# EAGLE design USBHUB (EAGLE 6.5.0)
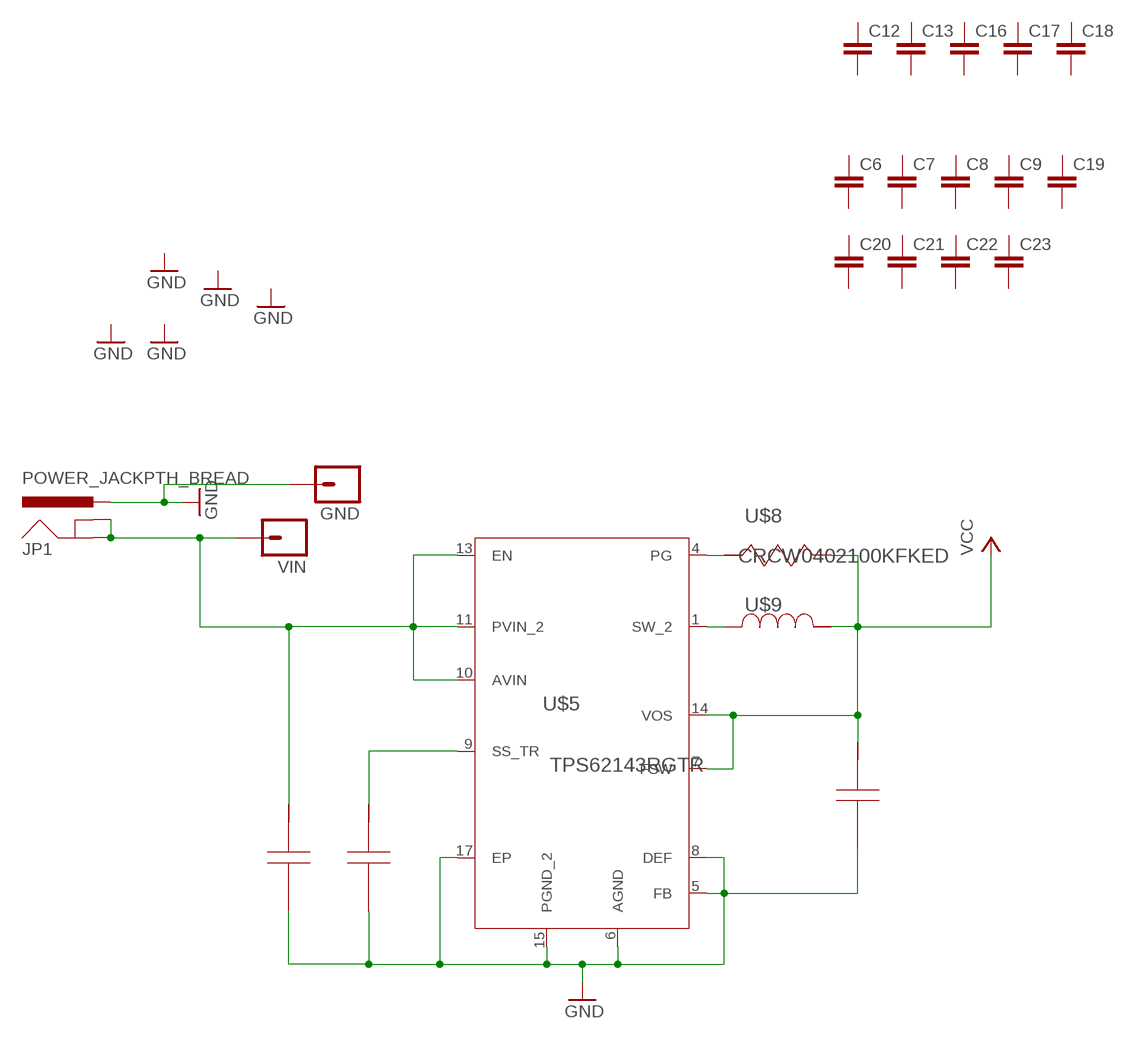
[diagram p0: schematic, sheet 1, part 1 of 2]
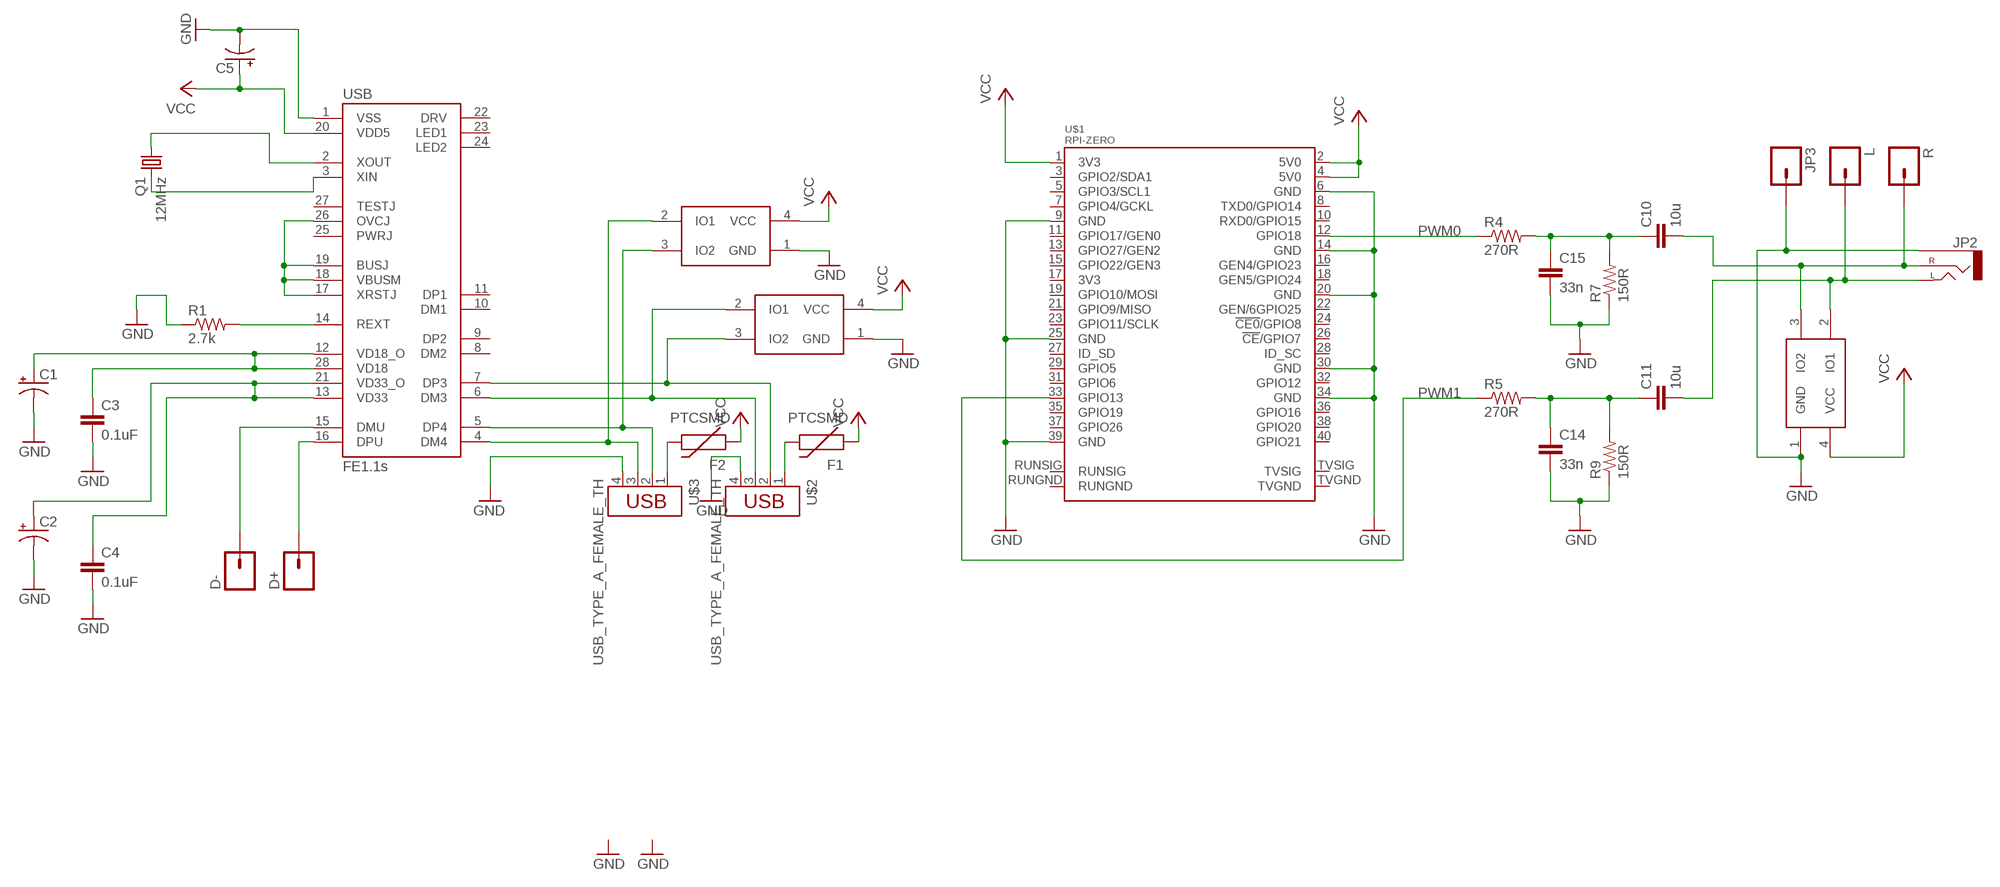
[diagram p1: schematic, sheet 1, part 2 of 2]

## Parts
C1  CAP_POL1206  [EIA3216]
C2  CAP_POL1206  [EIA3216]
C3  0.1uF  0.1UF-25V(+80/-20%)(0603)  [0603-CAP]
C4  0.1uF  0.1UF-25V(+80/-20%)(0603)  [0603-CAP]
C5  CAP_POL1206  [EIA3216]
C6  CAP0402-CAP  [0402-CAP]
C7  CAP0402-CAP  [0402-CAP]
C8  CAP0402-CAP  [0402-CAP]
C9  CAP0402-CAP  [0402-CAP]
C10  10u  CAP0603-CAP  [0603-CAP]
C11  10u  CAP0603-CAP  [0603-CAP]
C12  CAP0402-CAP  [0402-CAP]
C13  CAP0402-CAP  [0402-CAP]
C14  33n  CAP0603-CAP  [0603-CAP]
C15  33n  CAP0603-CAP  [0603-CAP]
C16  CAP0402-CAP  [0402-CAP]
C17  CAP0402-CAP  [0402-CAP]
C18  CAP0402-CAP  [0402-CAP]
C19  CAP0402-CAP  [0402-CAP]
C20  CAP0402-CAP  [0402-CAP]
C21  CAP0402-CAP  [0402-CAP]
C22  CAP0402-CAP  [0402-CAP]
C23  CAP0402-CAP  [0402-CAP]
D+  M01NOSILK-KIT  [1X01NS-KIT]
D-  M01NOSILK-KIT  [1X01NS-KIT]
F1  PTCSMD  [PTC-1206]
F2  PTCSMD  [PTC-1206]
GND  M01NOSILK-KIT  [1X01NS-KIT]
JP1  POWER_JACKPTH_BREAD  [POWER_JACK_PTH_BREAD]
JP2  AUDIO-JACKSMD2  [AUDIO-JACK-3.5MM-SMD]
JP3  M01NOSILK-KIT  [1X01NS-KIT]
L  M01NOSILK-KIT  [1X01NS-KIT]
Q1  12MHz  CRYSTALCTS406  [CTS406]
R  M01NOSILK-KIT  [1X01NS-KIT]
R1  2.7k  RESISTOR0603  [0603-RES]
R4  270R  RESISTOR0603-RES  [0603-RES]
R5  270R  RESISTOR0603-RES  [0603-RES]
R7  150R  RESISTOR0603-RES  [0603-RES]
R9  150R  RESISTOR0603-RES  [0603-RES]
U$1  RPI-ZERO  [RASPBERRYPI_BASTELSTUBE_V13_RASPI_BOARD_B+_FULL]
U$2  USB_TYPE_A_FEMALE_TH  [USB_TYPE_A_FEMALE_TH]
U$3  USB_TYPE_A_FEMALE_TH  [USB_TYPE_A_FEMALE_TH]
U$4  PRTR5VV0U2X  [SOT143B]
U$5  TPS62143RGTR  [S-PVQFN-N16]
U$6  PRTR5VV0U2X  [SOT143B]
U$7  PRTR5VV0U2X  [SOT143B]
U$8  CRCW0402100KFKED  [0402]
U$9  IHLP1212BZER2R2M11  [IHLP-1212BZ]
U$10  TMK316BJ106KL-T  [1206]
U$11  TMK316BJ106KL-T  [1206]
U$12  TMK316BJ106KL-T  [1206]
USB  FE1.1S  [FE1.1S_SSOP-28]
VIN  M01NOSILK-KIT  [1X01NS-KIT]

## Nets
3V3: U$1.1(3V3) U$7.4(VCC) ; supply symbol labelled VCC
GND: C1.C(-) C2.C(-) C3.2 C4.2 C5.C(-) C14.2 C15.2 GND.1 JP1.PWR JP2.SLEEVE JP3.1 R1.1 R7.1 R9.1 U$1.6(GND) U$1.9(GND) U$1.14(GND) U$1.20(GND) U$1.25(GND) U$1.30(GND) U$1.34(GND) U$1.39(GND) U$2.4 U$3.4 U$4.1(GND) U$5.5(FB) U$5.6(AGND) U$5.8(DEF) U$5.15(PGND_2) U$5.17(EP) U$6.1(GND) U$7.1(GND) U$10.2 U$11.2 U$12.2 USB.1(VSS)
N$1: U$2.3 U$4.2(IO1) USB.6(DM3)
N$2: U$2.2 U$4.3(IO2) USB.7(DP3)
N$3: U$5.1(SW_2) U$9.1
N$4: U$5.4(PG) U$8.2
N$5: D-.1 USB.15(DMU)
N$6: D+.1 USB.16(DPU)
N$7: USB.17(XRSTJ) USB.18(VBUSM) USB.19(BUSJ) USB.26(OVCJ)
N$8: Q1.1 USB.2(XOUT)
N$9: Q1.3 USB.3(XIN)
N$10: C2.A(+) C4.1 USB.13(VD33) USB.21(VD33_O)
N$11: U$3.3 U$6.2(IO1) USB.4(DM4)
N$12: R1.2 USB.14(REXT)
N$13: C1.A(+) C3.1 USB.12(VD18_O) USB.28(VD18)
N$16: F2.2 U$3.1
N$17: U$3.2 U$6.3(IO2) USB.5(DP4)
N$19: F1.2 U$2.1
N$20: C10.1 C15.1 R4.2 R7.2
N$21: C11.2 JP2.TIP(LEFT) L.1 U$7.2(IO1)
N$22: C11.1 C14.1 R5.2 R9.2
N$23: C10.2 JP2.RING(RIGHT) R.1 U$7.3(IO2)
N$24: U$5.9(SS_TR) U$11.1
PWM0: R4.1 U$1.12(GPIO18)
PWM1: R5.1 U$1.33(GPIO13)
VCC: C5.A(+) F1.1 F2.1 U$1.2(5V0) U$1.4(5V0) U$4.4(VCC) U$5.7(FSW) U$5.14(VOS) U$6.4(VCC) U$8.1 U$9.2 U$10.1 USB.20(VDD5)
VIN: JP1.GND JP1.GNDBREAK U$5.10(AVIN) U$5.11(PVIN_2) U$5.13(EN) U$12.1 VIN.1
Unconnected: C6.1 C6.2 C7.1 C7.2 C8.1 C8.2 C9.1 C9.2 C12.1 C12.2 C13.1 C13.2 C16.1 C16.2 C17.1 C17.2 C18.1 C18.2 C19.1 C19.2 C20.1 C20.2 C21.1 C21.2 C22.1 C22.2 C23.1 C23.2 U$1.3(GPIO2/SDA1) U$1.5(GPIO3/SCL1) U$1.7(GPIO4/GCKL) U$1.8(TXD0/GPIO14) U$1.10(RXD0/GPIO15) U$1.11(GPIO17/GEN0) U$1.13(GPIO27/GEN2) U$1.15(GPIO22/GEN3) U$1.16(GEN4/GPIO23) U$1.17(3V3) U$1.18(GEN5/GPIO24) U$1.19(GPIO10/MOSI) U$1.21(GPIO9/MISO) U$1.22(GEN/6GPIO25) U$1.23(GPIO11/SCLK) U$1.24(!CE0!/GPIO8) U$1.26(!CE!/GPIO7) U$1.27(ID_SD) U$1.28(ID_SC) U$1.29(GPIO5) U$1.31(GPIO6) U$1.32(GPIO12) U$1.35(GPIO19) U$1.36(GPIO16) U$1.37(GPIO26) U$1.38(GPIO20) U$1.40(GPIO21) U$1.RUNGND U$1.RUNSIG U$1.TVGND U$1.TVSIG USB.8(DM2) USB.9(DP2) USB.10(DM1) USB.11(DP1) USB.22(DRV) USB.23(LED1) USB.24(LED2) USB.25(PWRJ) USB.27(TESTJ)

## Library data of the parts
C1 C2 C5 = SparkFun-Capacitors:CAP_POL: Capacitor Polarized These are standard SMD and PTH capacitors. Normally 10uF, 47uF, and 100uF in electrolytic and tantalum varieties. Always verify the external diameter of the through hole cap, it varies with capacity, voltage, and manufacturer. The EIA devices should be standard.
C3 C4 = SparkFun-Capacitors:0.1UF-25V(+80/-20%)(0603): CAP-00810 Ceramic Standard decoupling cap; PROD_ID: CAP-00810
C6-C23 = SparkFun-Passives:CAP: Capacitor Standard 0603 ceramic capacitor, and 0.1" leaded capacitor.
D+ D- GND JP3 L R VIN = SparkFun-Connectors:M01: Header 1 Standard 1-pin 0.1" header. Use with straight break away headers (SKU : PRT-00116), right angle break away headers (PRT-00553), swiss pins (PRT-00743), machine pins (PRT-00117), and female headers (PRT-00115).
F1 F2 = SparkFun-PowerIC:PTC: Resettable Fuse PTC Resettable Fuse. Spark Fun Electronics SKU : COM-08357; PROD_ID: RES-11150
JP1 = SparkFun-Connectors:POWER_JACK: Power Jack This is the standard 5.5mm barrel jack for power. The PTH is the most common, proven, reliable, footprint. The Slot footprint only works if the mill layer is transmitted to the PCB fab house so be warned. Mating wall wart : TOL-00298 (and others); PROD_ID: PRT-10811
JP2 = SparkFun-Connectors:AUDIO-JACK: 3.5mm Audio Jack Simple 3.5mm common PCB mount audio jack. Variant PTH is our storefront SKU PRT-08032; PROD_ID: CONN-10353
Q1 = adafruit:CRYSTAL: CRYSTAL; OC_FARNELL: unknown; OC_NEWARK: unknown
R1 = SparkFun-Resistors:RESISTOR: Resistor Basic schematic elements and footprints for 0603, 1206, and PTH resistors.
R4 R5 R7 R9 = SparkFun-Passives:RESISTOR: Resistor Basic schematic elements and footprints for 0603, 1206, and PTH resistors.
U$1 = RPI-Zero:RPI-ZERO
U$2 U$3 = imcom:USB_TYPE_A_FEMALE_TH: USB Type A Female Through Hole. http://datasheet.octopart.com/787616-1-Tyco-Electronics-datasheet-61477.pdf
U$4 U$6 U$7 = Benchoff:PRTR5VV0U2X
U$5 = TI Library 1:TPS62143RGTR; DATASHEETURL: http://www.ti.com/product/tps62131; FREQUENCY: 2500000.0; IMAX: 3.0; MANUFACTURER_NAME: Texas Instruments; MANUFACTURER_PART_NUMBER: TPS62131RGTR; MKTG_PACKAGE: S-PVQFN-N16; NSID: TPS62131RGTR; PACKAGE: S-PVQFN-N16; VENDOR: Texas Instruments
U$8 = TI Library 1:CRCW0402100KFKED; MANUFACTURER_NAME: Vishay-Dale; MANUFACTURER_PART_NUMBER: CRCW0402100KFKED; POWER: 0.063; RESISTANCE: 100000.0; TOLERANCE: 1.0; VENDOR: Vishay-Dale
U$9 = TI Library 1:IHLP1212BZER2R2M11; DATASHEETURL: http://www.vishay.com/docs/34289/lp12bz11.pdf; DCR: 46.0; DESCRIPTION: Unknown; IDC: 3.0; L: 2.2E-6; MANUFACTURER: Vishay; MANUFACTURER_NAME: Vishay-Dale; MANUFACTURER_PART_NUMBER: IHLP1212BZER2R2M11; PACKAGE_DESIGNATOR: IHLP-1212BZ; VENDOR: Vishay-Dale
U$10-U$12 = TI Library 1:TMK316BJ106KL-T; CAP: 1.0E-5; ESR: 0.0; IRMS: 0.0; MANUFACTURER_NAME: Taiyo Yuden; MANUFACTURER_PART_NUMBER: TMK316BJ106KL-T; VDC: 25.0; VENDOR: Taiyo Yuden
USB = imcom:FE1.1S: A USB 2.0 hub IC. http://www.jfd-ic.com/Documents/FE1.1s%20Data%20Sheet%20%28Rev.%201.0%29.pdf

## Board
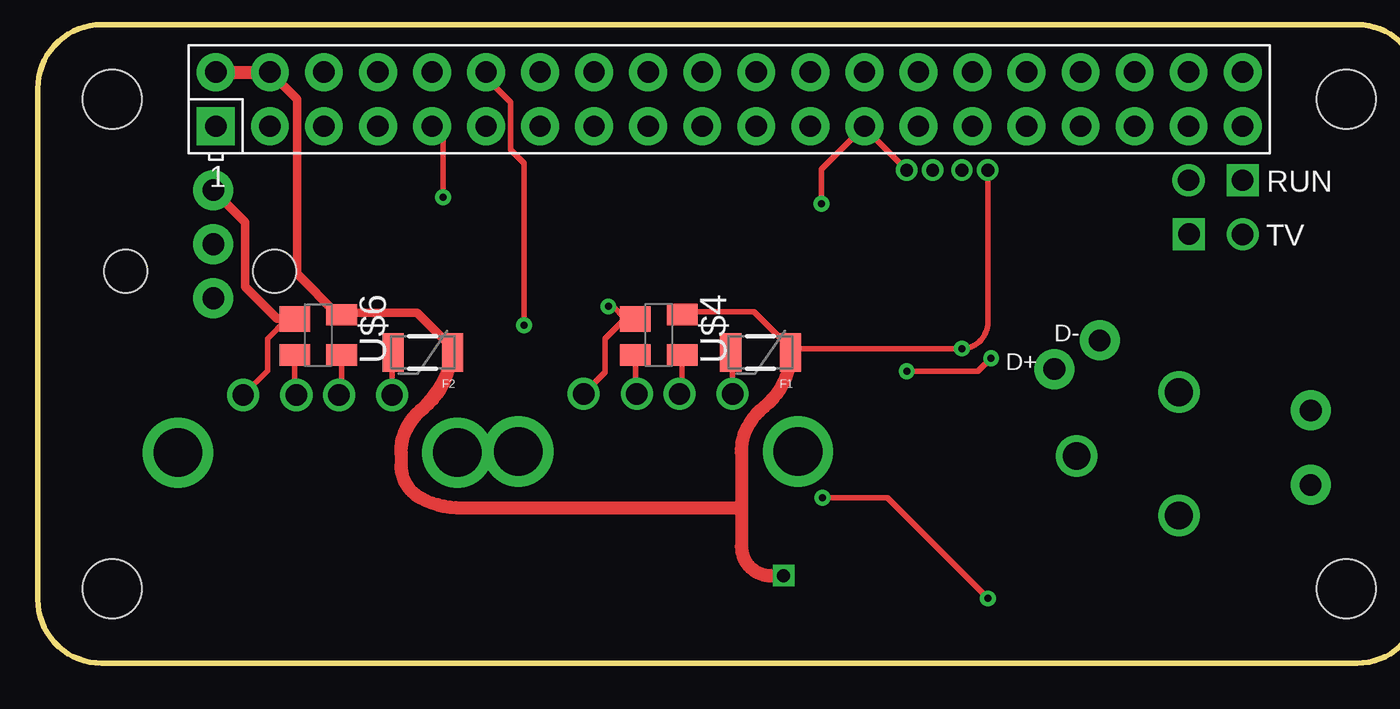
[diagram p2: board, top side]
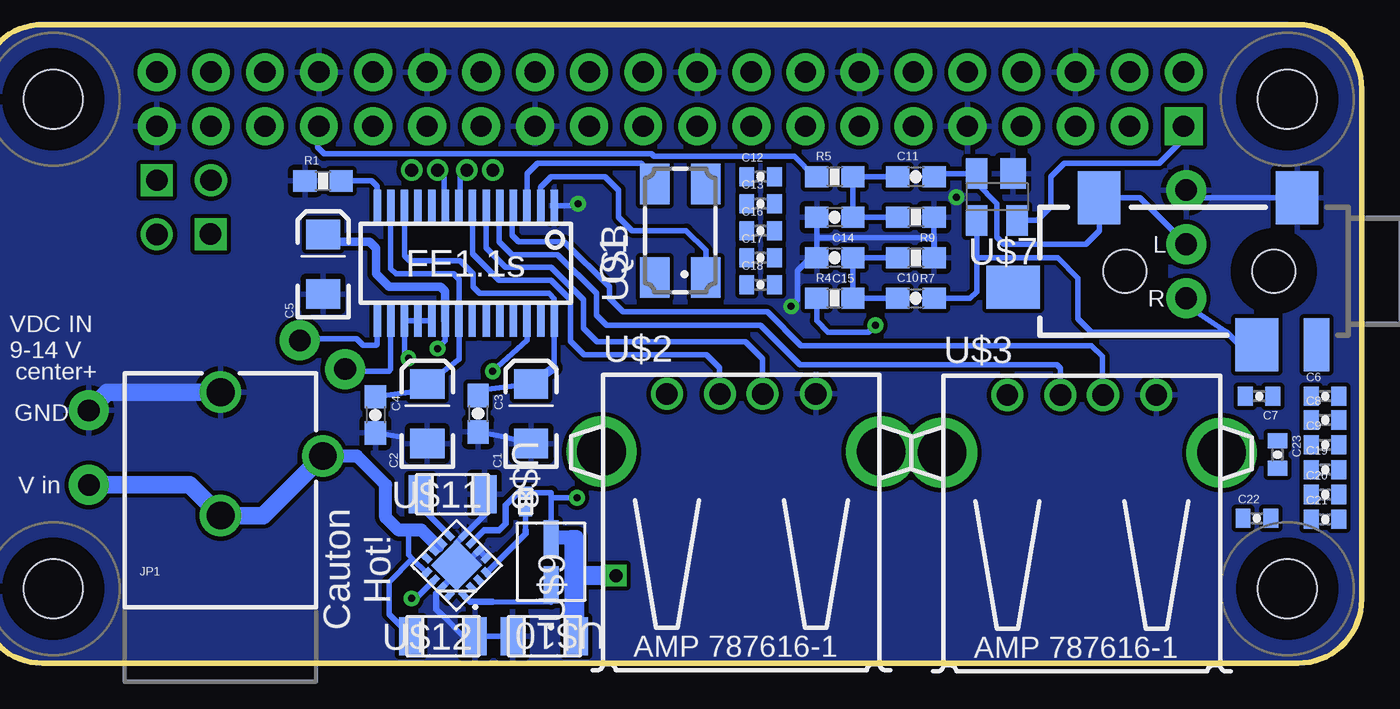
[diagram p3: board, bottom side, seen from below]

No outline drawn. Coordinates in mm, seen from the top.
Copper layers (1*16): Top 0.035mm / dielectric 1.5mm / Bottom 0.035mm
Design rules "default": minimum track width 10mil, minimum drill 24mil, track to track 8mil, track to pad 8mil, pad to pad 8mil, via to via 8mil, smd to smd 8mil, copper to edge 40mil, drill to drill 8mil, minimum pad ring 10mil, minimum via ring 8mil, stop-mask expansion 4mil, vias tented up to drill 0mil, thermal gap 10mil
Milling: 8 lines

### Footprints (pad centres in the part's own frame; a part is rotated, then mirrored left to right if it is on the bottom)
EIA3216 = smd 1.4 x 1.6: A 1.4,0; C -1.4,0
0603-CAP = smd 1.1 x 1: 1 -0.85,0; 2 0.85,0
0402-CAP = smd 0.7 x 0.9: 1 -0.65,0; 2 0.65,0
1X01NS-KIT = drill 1.016 pad 1.88: 1 0,0
PTC-1206 = smd 1 x 1.8: 1 -1.4,0; 2 1.4,0
POWER_JACK_PTH_BREAD = drill 1.3: GND 0,7.9; GNDBREAK 4.8,10.7; PWR 0,13.7
AUDIO-JACK-3.5MM-SMD = smd 2 x 2.5: RING 4.3,3.45; SLEEVE 2.4,-3.45; TIP 11.7,-3.45 | smd 1.2 x 2.5: RSH 1.5,3.45 | smd 2.5 x 2: TSH 15.75,0.75 | hole 2: 3.5,0; 10.5,0
CTS406 = smd 1.9 x 1.4: 1 -2.2,-1.2; 2 2.2,-1.2; 3 2.2,1.2; 4 -2.2,1.2
0603-RES = smd 1.1 x 1: 1 -0.85,0; 2 0.85,0
RASPBERRYPI_BASTELSTUBE_V13_RASPI_BOARD_B+_FULL = drill 1 pad 1.778 square: 1 8.37,25.23 | drill 1 pad 1.778: 2 8.37,27.77; 3 10.91,25.23; 4 10.91,27.77; 5 13.45,25.23; 6 13.45,27.77; 7 15.99,25.23; 8 15.99,27.77; 9 18.53,25.23; 10 18.53,27.77; 11 21.07,25.23; 12 21.07,27.77; 13 23.61,25.23; 14 23.61,27.77; 15 26.15,25.23; 16 26.15,27.77; 17 28.69,25.23; 18 28.69,27.77; 19 31.23,25.23; 20 31.23,27.77; 21 33.77,25.23; 22 33.77,27.77; 23 36.31,25.23; 24 36.31,27.77; 25 38.85,25.23; 26 38.85,27.77; 27 41.39,25.23; 28 41.39,27.77; 29 43.93,25.23; 30 43.93,27.77; 31 46.47,25.23; 32 46.47,27.77; 33 49.01,25.23; 34 49.01,27.77; 35 51.55,25.23; 36 51.55,27.77; 37 54.09,25.23; 38 54.09,27.77; 39 56.63,25.23; 40 56.63,27.77 | drill 1: RUNGND 54.087,22.687; TVGND 56.629,20.145 | drill 1 square: RUNSIG 56.629,22.687; TVSIG 54.105,20.163 | hole 2.75: 3.5,3.5; 3.5,26.5; 61.5,3.5; 61.5,26.5
USB_TYPE_A_FEMALE_TH = drill 1: 1 -3.5,5.37; 2 -1,5.37; 3 1,5.37; 4 3.5,5.37 | drill 2.286: P$1 -6.57,2.66; P$2 6.57,2.66
SOT143B = smd 1.2 x 1.44: 1 -0.75,-1.1 | smd 1 x 1.44: 2 0.95,-1.1; 3 0.95,1.1; 4 -0.95,1.1
S-PVQFN-N16 = smd 0.508 x 0.305: 1 -1.25,0.75; 2 -1.25,0.25; 3 -1.25,-0.25; 4 -1.25,-0.75; 9 1.25,-0.75; 10 1.25,-0.25; 11 1.25,0.25; 12 1.25,0.75 | smd 0.305 x 0.508: 5 -0.75,-1.25; 6 -0.25,-1.25; 7 0.25,-1.25; 8 0.75,-1.25; 13 0.75,1.25; 14 0.25,1.25; 15 -0.25,1.25; 16 -0.75,1.25 | smd 1.702 x 1.702: 17 0,0
0402 = smd 0.559 x 0.61: 1 -0.419,0; 2 0.419,0
IHLP-1212BZ = smd 1.753 x 0.711: 1 -1.079,0; 2 1.079,0
1206 = smd 1.118 x 1.803: 1 -1.499,0; 2 1.499,0
FE1.1S_SSOP-28 = smd 0.35 x 1.5: 1 -4.16,-2.7; 2 -3.52,-2.7; 3 -2.88,-2.7; 4 -2.24,-2.7; 5 -1.6,-2.7; 6 -0.96,-2.7; 7 -0.32,-2.7; 8 0.32,-2.7; 9 0.96,-2.7; 10 1.6,-2.7; 11 2.24,-2.7; 12 2.88,-2.7; 13 3.52,-2.7; 14 4.16,-2.7; 15 4.16,2.7; 16 3.52,2.7; 17 2.88,2.7; 18 2.24,2.7; 19 1.6,2.7; 20 0.96,2.7; 21 0.32,2.7; 22 -0.3,2.7; 23 -0.96,2.7; 24 -1.6,2.7; 25 -2.24,2.7; 26 -2.88,2.7; 27 -3.52,2.7; 28 -4.16,2.7

### Placement (x,y rotation side)
C1  39.04,11.72 90 bottom
C2  43.92,11.72 90 bottom
C3  41.53,11.72 270 bottom
C4  46.35,11.67 270 bottom
C5  48.82,18.75 90 bottom
C6  1.73,12.55 0 bottom
C7  4.83,12.55 180 bottom
C8  1.73,11.43 0 bottom
C9  1.73,10.26 0 bottom
C10  20.95,17.14 0 bottom
C11  20.95,22.86 0 bottom
C12  28.26,22.86 0 bottom
C13  28.26,21.59 0 bottom
C14  24.77,20.95 180 bottom
C15  24.77,19.05 180 bottom
C16  28.26,20.32 0 bottom
C17  28.26,19.05 0 bottom
C18  28.26,17.78 0 bottom
C19  1.73,9.09 0 bottom
C20  1.73,7.92 0 bottom
C21  1.73,6.76 0 bottom
C22  4.93,6.81 0 bottom
C23  3.96,9.8 270 bottom
D+  47.78,13.82 0 top
D-  49.91,15.16 0 top
F1  33.97,14.61 180 top
F2  18.1,14.61 180 top
GND  59.83,11.88 0 top
JP1  53.63,-0.97 0 bottom
JP2  0.64,18.41 180 bottom
JP3  8.26,22.23 0 top
L  8.26,19.68 0 top
Q1  32.03,20.32 90 bottom
R  8.26,17.14 0 top
R1  48.82,22.66 0 bottom
R4  24.77,17.14 0 bottom
R5  24.77,22.86 0 bottom
R7  20.95,19.05 180 bottom
R9  20.95,20.95 180 bottom
U$1  0,0 0 top
U$2  29.16,7.28 0 bottom
U$3  13.16,7.23 0 bottom
U$4  29.19,15.43 270 top
U$5  42.55,4.6 135 bottom
U$6  13.18,15.42 270 top
U$7  17.14,21.91 180 bottom
U$8  39.29,7.6 270 bottom
U$9  38.1,4.76 90 bottom
U$10  38.42,1.27 180 bottom
U$11  42.73,7.94 0 bottom
U$12  43.18,1.27 0 bottom
USB  42.11,18.8 180 bottom
VIN  59.82,8.38 0 top

### Tracks (layer width: path | path; a pad name or v marks a point on that pad's centre or on a via)
3V3
  Bottom 0.254: U$1.1 8.37,24.65 9.53,23.5 13.97,23.5 14.61,22.86 14.61,21.44 15.24,20.81 U$7.4
GND  (via drill 0.33)
  Top 0.254: U$4.1 27.61,16.18 | 27.61,16.18 26.67,15.24 26.67,13.66 U$2.4 | U$6.1 11.73,16.18 10.79,15.24 10.79,13.74 U$3.4 | 27.61,16.18 27.03,16.76 v26.82,16.76 | v36.83,21.59 36.83,23.21 U$1.25 | v19.05,21.89 19.05,24.71 U$1.9
  Top 0.406: 11.73,16.18 11.26,16.18 9.75,17.68 9.75,20.73 JP3.1
  Bottom 0.254: C1.C 40.34,10.64 C3.2 | 43.37,10.87 C2.C | 45.22,10.64 C4.2 | 20.11,19.99 R7.1 20.09,19.99 20.11,19.99 | 20.11,19.99 R9.1 19.68,20.95 | C15.2 C14.2 | C15.2 25.6,19.99 20.11,19.99 | JP2.SLEEVE 7.89,21.86 JP3.1 | U$5.5 U$5.6 42.19,4.6 U$5.17 42.55,4.24 U$5.15 43.5,3.29 | U$10.2 U$12.2 42.23,1.27 43.18,2.22 | v26.82,16.76 26.52,17.07 26.52,18.44 25.91,19.05 C15.2 | U$11.2 41.23,8.13 | USB.1 36.92,21.5 v36.83,21.59
  Bottom 0.305: U$5.17 42.55,5.66 U$5.8 41.23,6.97 U$11.2 | 43.5,3.29 43.5,2.54 43.18,2.22
  Bottom 0.813: GND.1 58.97,12.73 JP1.PWR
  pour Bottom: 3.51,30.02 arc90 0,26.52 0,3.2 arc90 3.2,0 3.35,0 61.57,0 62.03,0 arc90 64.92,2.9 64.92,4.27 64.92,26.97 arc90 61.87,30.02
N$1
  Top 0.254: U$4.2 28.09,12.73 U$2.3
  Bottom 0.254: USB.6 41.15,19.51 40.23,18.59 38.1,18.59 36.58,17.07 36.58,15.74 35.94,15.11 28.96,15.11 28.16,14.31 U$2.3
N$2
  Top 0.254: U$4.3 30.29,12.78 U$2.2
  Bottom 0.254: USB.7 41.79,19.24 40.54,17.98 38.1,17.98 37.19,17.07 37.19,15.13 36.55,14.5 30.79,14.5 30.18,13.89 30.18,12.67 U$2.2
N$3
  Bottom 0.254: 40.84,2.9 38.1,2.86 U$9.1
  Bottom 0.305: U$5.1 41.9,2.9 40.84,2.9
N$4
  Bottom 0.254: 39.29,6.25 U$8.2
  Bottom 0.305: U$5.4 39.29,6.08 39.29,6.25
N$5
  Bottom 0.254: USB.15 46.27,14.99 46.33,14.94 46.94,14.94 47.24,15.24 49.84,15.24 D-.1
N$6
  Bottom 0.254: USB.16 45.63,13.8 45.72,13.72 47.68,13.72 D+.1
N$7  (via drill 0.33 pad 0.25)
  Top 0.254: v40.84,13.72 44.2,13.72 v44.81,14.33
  Bottom 0.254: USB.19 USB.18 USB.17 44.99,14.51 v44.81,14.33 | USB.26 39.23,15.17 v40.84,13.72
N$8
  Bottom 0.254: Q1.1 30.83,19.4 31.75,20.32 34.29,20.32 34.92,20.95 34.92,22.23 35.56,22.86 38.1,22.86 38.59,22.37 USB.2
N$9
  Bottom 0.254: USB.3 39.23,23 38.73,23.5 33.86,23.5 33.23,22.86 Q1.3
N$10
  Bottom 0.254: C4.1 43.88,12.84 C2.A 42.43,14.29 USB.21 42.43,18.05 42.67,18.29 45.38,18.29 45.63,18.54 USB.13
N$11
  Top 0.254: U$6.2 12.08,12.68 U$3.3
  Bottom 0.254: USB.4 39.93,21.44 39.93,20.12 39.62,19.81 37.49,19.81 35.36,17.68 35.36,17.14 34.72,16.51 27.94,16.51 26.35,14.92 12.7,14.92 12.19,14.41 12.19,12.64 U$3.3
N$12
  Bottom 0.254: USB.14 46.27,22.4 46.53,22.66 R1.2
N$13
  Bottom 0.254: C1.A 41.61,12.8 C3.1 | 37.95,13.89 USB.28 37.95,17.12 38.21,17.37 41.45,17.37 41.76,17.68 41.76,18.29 42.37,18.9 44.74,18.9 44.99,19.15 USB.12
  Bottom 0.406: C1.A 37.95,13.89
N$14
  Bottom 0.61: 36.83,1.27 36.83,3.81 36.88,3.81 36.88,4.27 | 36.88,4.27 36.88,5.94 37.19,5.94 | 37.8,5.94 37.19,5.94 | 37.19,5.94 37.19,2.13 | 36.88,4.27 35.05,4.27
N$15
  Top 0.254: 16.66,14.47 16.66,12.6
N$16
  Top 0.254: F2.2 16.66,14.56 U$3.1
N$17
  Top 0.254: U$6.3 14.28,12.73 U$3.2
  Bottom 0.254: USB.5 40.54,21.47 40.54,19.81 39.93,19.2 37.8,19.2 35.97,17.37 35.97,16.35 35.49,15.88 28.26,15.88 26.4,14.02 14.33,14.02 14.16,13.85 U$3.2
N$18  (via drill 0.6)
  Bottom 0.254: 43.13,21.95 43.13,22.86 arc-90 v43.43,23.16
N$19
  Top 0.254: F1.2 32.66,14.52 U$2.1
N$20
  Bottom 0.254: C10.1 R4.2 C15.1 R7.2
N$21
  Bottom 0.254: C11.2 19.96,23.01 U$7.2 18.09,22.54 17.14,21.59 17.14,20 16.83,19.68 12.97,19.68 12.34,20.32 JP2.TIP 10.44,21.86 L.1
N$22
  Bottom 0.254: C11.1 R5.2 C14.1 R9.2
N$23
  Bottom 0.254: U$7.3 18.1,19.05 | 18.1,19.05 14.29,19.05 13.34,18.1 13.34,16.19 12.7,15.56 6.35,15.56 | 6.35,15.56 5.76,14.96 JP2.RING | C10.2 18.41,17.14 18.1,17.46 18.1,19.05 | R.1 8.26,16.83 6.35,15.56
N$24
  Bottom 0.305: U$5.9 44.23,7.34 U$11.1
N$25  (via drill 0.6)
  Bottom 0.254: 42.37,21.95 42.37,22.86 arc90 v42.06,23.16
N$26  (via drill 0.6)
  Top 0.254: v40.84,23.16 38.86,25.15 38.86,25.3
PWM0  (via drill 0.33)
  Top 0.254: v22.86,15.88 22.86,23.5 22.23,24.13 22.23,26.35 21.07,27.51 U$1.12
  Bottom 0.254: R4.1 25.61,16.09 25.08,15.56 23.18,15.56 v22.86,15.88
PWM1
  Bottom 0.254: R5.1 25.72,22.86 26.67,23.81 33.26,23.81 33.38,23.93 48.77,23.93 49.07,24.23 49.07,25.17 U$1.33
VCC  (via drill 0.33, 0.6)
  Top 0.254: U$4.4 30.61,16.38 30.74,16.51 33.66,16.51 35.37,14.79 F1.1 35.55,14.78 v43.43,14.78 arc90 44.65,16 v44.65,23.16 | U$6.4 14.42,16.38 14.56,16.51 17.78,16.51 19.36,14.94 19.5,14.79 F2.1 | v44.65,3.05 39.93,7.77 v36.88,7.77
  Top 0.406: U$1.4 12.19,26.49 12.19,18.29 14.11,16.38 U$6.4 | 14.17,16.46 17.83,16.46 19.36,14.94
  Top 0.61: F1.1 arc-51 34.14,12.04 arc29 33.22,10.82 arc26 33.07,9.91 33.07,7.32 | 33.07,7.32 33.07,5.49 arc90 34.44,4.12 v35.05,4.12 | 33.07,7.32 19.66,7.32 arc-26 17.98,7.77 arc-62 17.07,9.3 17.07,9.91 arc-50 17.98,11.89 arc41 F2.1 | U$1.2 U$1.4
  Bottom 0.254: 39.64,8.02 U$8.1 38.1,8.02 38.1,7.77 | 38.1,7.77 U$9.2 38.1,5.71 37.15,5.71 37.15,3.96 37.15,1.27 U$10.1 | U$5.14 44.45,3.05 v44.65,3.05 | v36.88,7.77 38.1,7.77 | USB.20 43.07,15.14 v43.43,14.78
  Bottom 0.305: 39.64,8.02 40.23,7.43 40.23,6.55 40.54,6.25 41.25,6.25 U$5.7
  Bottom 0.406: USB.20 43.07,17.47 43.28,17.68 45.72,17.68 46.33,18.29 46.33,19.51 46.63,19.81 48.49,19.81 C5.A
  Bottom 0.61: v35.05,4.12 arc90 35.2,3.96 37.15,3.96
VCC1
  Top 0.61: 19.37,14.55 arc-51 18.14,11.99 arc29 17.22,10.77 arc26 17.07,9.86
VIN
  Bottom 0.254: U$5.10 U$5.11 43.43,5.48 43.43,5.49 | U$5.13 44.62,4.91 | 44.62,4.91 44.81,5.09 44.81,6.25 | U$12.1 45.72,2.31 45.72,3.81 44.62,4.91 | 44.62,4.91
  Bottom 0.61: 43.43,5.49 44.2,6.25 44.81,6.25 45.26,6.25 45.87,6.86 45.87,8.38 47.23,9.73 JP1.GNDBREAK
  Bottom 0.813: JP1.GNDBREAK 51.63,6.93 JP1.GND 55.08,8.38 VIN.1

### Text on the board
tPlace: D- | D+
bPlace: L | R | center+ | VDC IN / 9-14 V | GND | V in | Cauton / Hot!